# EAGLE design CDCEmu_v4.0 (EAGLE 9.6.2)
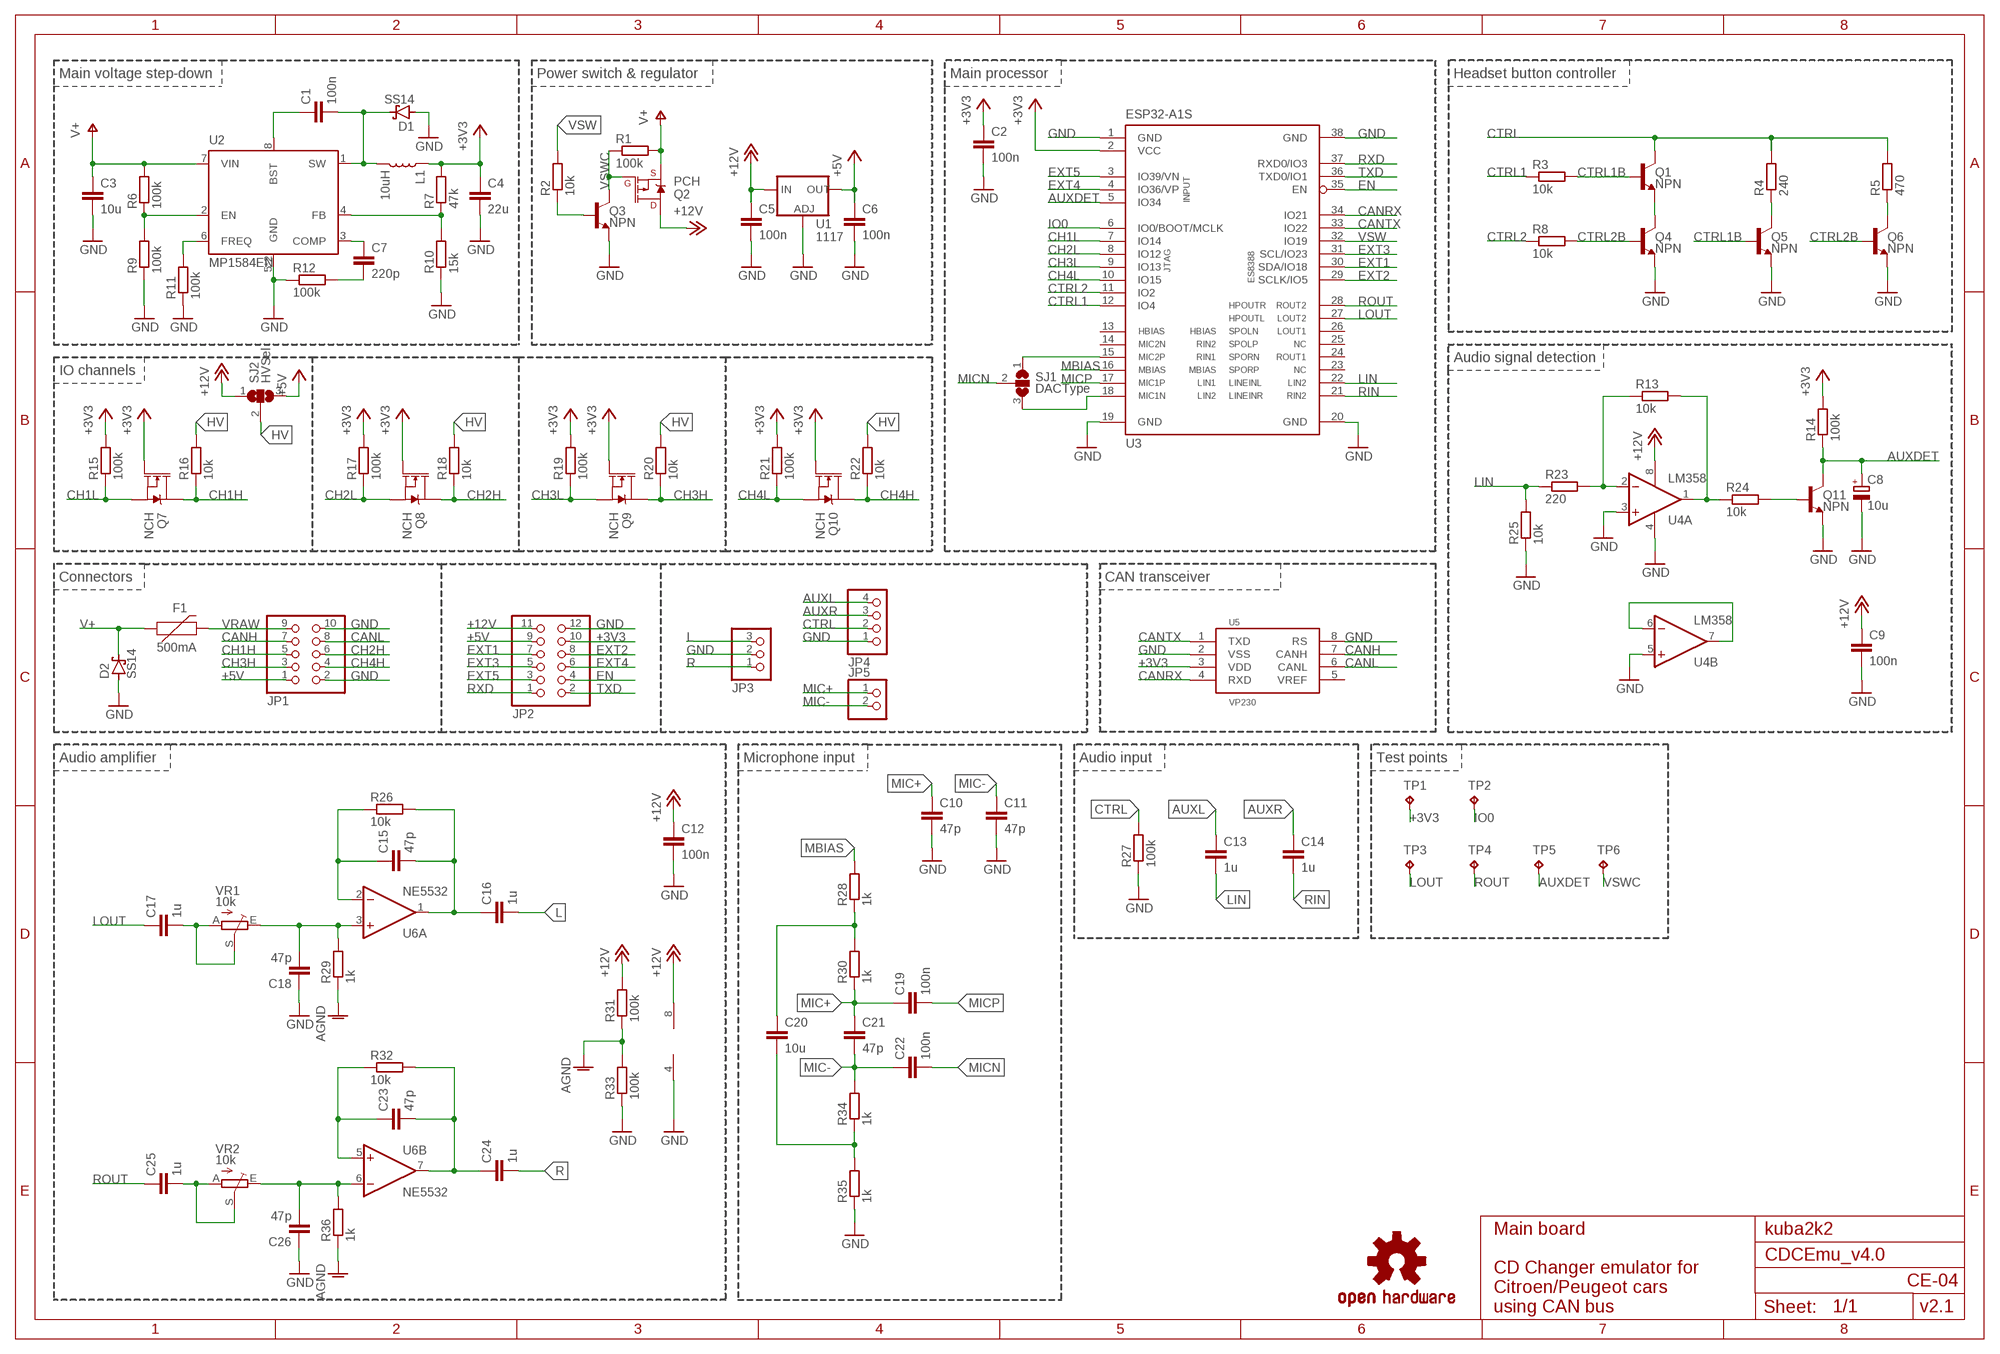
[diagram p0: schematic, sheet 1]

## Parts
C1  100n  C-EUC0805  [C0805]
C2  100n  C-EUC0805  [C0805]
C3  10u  C-EUC1206  [C1206]
C4  22u  C-EUC1206  [C1206]
C5  100n  C-EUC0805  [C0805]
C6  100n  C-EUC0805  [C0805]
C7  220p  C-EUC0805  [C0805]
C8  10u  CPOL-EUC1206  [C1206-POL]
C9  100n  C-EUC0805  [C0805]
C10  47p  C-EUC0805  [C0805]
C11  47p  C-EUC0805  [C0805]
C12  100n  C-EUC0805  [C0805]
C13  1u  C-EUC0805  [C0805]
C14  1u  C-EUC0805  [C0805]
C15  47p  C-EUC0805  [C0805]
C16  1u  C-EUC0805  [C0805]
C17  1u  C-EUC0805  [C0805]
C18  47p  C-EUC0805  [C0805]
C19  100n  C-EUC0805  [C0805]
C20  10u  C-EUC1206  [C1206]
C21  47p  C-EUC0805  [C0805]
C22  100n  C-EUC0805  [C0805]
C23  47p  C-EUC0805  [C0805]
C24  1u  C-EUC0805  [C0805]
C25  1u  C-EUC0805  [C0805]
C26  47p  C-EUC0805  [C0805]
D1  SS14  [DO-214AC]
D2  SS14  [DO-214AC]
F1  500mA  PPTC_6V500MA  [0805]
JP1  PINHD-2X5/90  [2X05/90]
JP2  PINHD-2X6/90  [2X06/90]
JP3  PINHD-1X3/90  [1X03/90]
JP4  PINHD-1X4/90  [1X04/90]
JP5  PINHD-1X2/90  [1X02/90]
L1  10uH  INDUCTOR-CR75-68UH  [CR75]
Q1  NPN  TRANS_NPN-MMBTA42  [SOT23-3]
Q2  PCH  MOSFET_PCH-IRLML2244  [SOT23-3]
Q3  NPN  TRANS_NPN-MMBTA42  [SOT23-3]
Q4  NPN  TRANS_NPN-MMBTA42  [SOT23-3]
Q5  NPN  TRANS_NPN-MMBTA42  [SOT23-3]
Q6  NPN  TRANS_NPN-MMBTA42  [SOT23-3]
Q7  NCH  MOSFET-NCH-AO3404A  [SOT23-3]
Q8  NCH  MOSFET-NCH-AO3404A  [SOT23-3]
Q9  NCH  MOSFET-NCH-AO3404A  [SOT23-3]
Q10  NCH  MOSFET-NCH-AO3404A  [SOT23-3]
Q11  NPN  TRANS_NPN-MMBTA42  [SOT23-3]
R1  100k  R-EU_R0805  [R0805]
R2  10k  R-EU_R0805  [R0805]
R3  10k  R-EU_R0805  [R0805]
R4  240  R-EU_R0805  [R0805]
R5  470  R-EU_R0805  [R0805]
R6  100k  R-EU_R0805  [R0805]
R7  47k  R-EU_R0805  [R0805]
R8  10k  R-EU_R0805  [R0805]
R9  100k  R-EU_R0805  [R0805]
R10  15k  R-EU_R0805  [R0805]
R11  100k  R-EU_R0805  [R0805]
R12  100k  R-EU_R0805  [R0805]
R13  10k  R-EU_R0805  [R0805]
R14  100k  R-EU_R0805  [R0805]
R15  100k  R-EU_R0805  [R0805]
R16  10k  R-EU_R0805  [R0805]
R17  100k  R-EU_R0805  [R0805]
R18  10k  R-EU_R0805  [R0805]
R19  100k  R-EU_R0805  [R0805]
R20  10k  R-EU_R0805  [R0805]
R21  100k  R-EU_R0805  [R0805]
R22  10k  R-EU_R0805  [R0805]
R23  220  R-EU_R0805  [R0805]
R24  10k  R-EU_R0805  [R0805]
R25  10k  R-EU_R0805  [R0805]
R26  10k  R-EU_R0805  [R0805]
R27  100k  R-EU_R0805  [R0805]
R28  1k  R-EU_R0805  [R0805]
R29  1k  R-EU_R0805  [R0805]
R30  1k  R-EU_R0805  [R0805]
R31  100k  R-EU_R0805  [R0805]
R32  10k  R-EU_R0805  [R0805]
R33  100k  R-EU_R0805  [R0805]
R34  1k  R-EU_R0805  [R0805]
R35  1k  R-EU_R0805  [R0805]
R36  1k  R-EU_R0805  [R0805]
SJ1  DACType  SJ2W  [SJ_2]
SJ2  HVSel  SJ2W  [SJ_2]
TP1  TPB1,27  [B1,27]
TP2  TPB1,27  [B1,27]
TP3  TPB1,27  [B1,27]
TP4  TPB1,27  [B1,27]
TP5  TPB1,27  [B1,27]
TP6  TPB1,27  [B1,27]
U1  1117  V_REG_LM1117SOT223  [SOT223]
U2  MP1584EN  MP1584EN_-PAD  [SO08-PAD]
U3  ESP32-A1S  [ESP32-A1S]
U4  LM358  LM358D  [SO08]
U5  VP230  SN65HVD230  [SO08]
U6  NE5532  LM358D  [SO08]
U$1  OSHW-LOGO  [OSHWLOGO_TOP_0.2_OUTLINE]
VR1  10k  TRIM_EU-CA6V  [CA6V]
VR2  10k  TRIM_EU-CA6V  [CA6V]

## Nets
+3V3 [power]: C2.1 C4.1 JP2.10 L1.P$1 Q7.1(G) Q8.1(G) Q9.1(G) Q10.1(G) R7.2 R14.2 R15.2 R17.2 R19.2 R21.2 TP1.TP U3.2(VCC) U5.3(VDD)
+5V [power]: C6.1 JP1.1 JP2.9 SJ2.3 U1.2(OUT) U1.4(OUT)
+12V [power]: C5.1 C9.1 C12.1 JP2.11 Q2.3(D) R31.2 SJ2.1 U1.3(IN) U4.8(P:V+) U6.8(P:V+)
AGND: R29.1 R31.1 R33.2 R36.1
AUXDET: C8.1(+) Q11.3(C) R14.1 TP5.TP U3.5(IO34)
AUXL: C13.1 JP4.4
AUXR: C14.1 JP4.3
BST: C1.1 U2.8(BST)
CANH: JP1.7 U5.7(CANH)
CANL: JP1.8 U5.6(CANL)
CANRX: U3.34(IO21) U5.4(RXD)
CANTX: U3.33(IO22) U5.1(TXD)
CCE: Q1.2(E) Q4.3(C)
CH1H: JP1.5 Q7.3(D) R16.1
CH1L: Q7.2(S) R15.1 U3.7(IO14)
CH2H: JP1.6 Q8.3(D) R18.1
CH2L: Q8.2(S) R17.1 U3.8(IO12)
CH3H: JP1.3 Q9.3(D) R20.1
CH3L: Q9.2(S) R19.1 U3.9(IO13)
CH4H: JP1.4 Q10.3(D) R22.1
CH4L: Q10.2(S) R21.1 U3.10(IO15)
COMP: C7.1 U2.3(COMP)
COMPD: C7.2 R12.2
CTRL: JP4.2 Q1.3(C) R4.2 R5.2 R27.2
CTRL1: R3.1 U3.12(IO4)
CTRL1B: Q1.1(B) Q5.1(B) R3.2
CTRL2: R8.1 U3.11(IO2)
CTRL2B: Q4.1(B) Q6.1(B) R8.2
DET-: R13.1 R23.2 U4.2(A:-IN)
DET_B: Q11.1(B) R24.2
DETOUT: R13.2 R24.1 U4.1(A:OUT)
EN: JP2.4 U3.35(EN)
EXT1: JP2.7 U3.30(SDA/IO18)
EXT2: JP2.8 U3.29(SCLK/IO5)
EXT3: JP2.5 U3.31(SCL/IO23)
EXT4: JP2.6 U3.4(IO36/VP)
EXT5: JP2.3 U3.3(IO39/VN)
FB: R7.1 R10.2 U2.4(FB)
FREQ: R11.2 U2.6(FREQ)
GND: C2.2 C3.2 C4.2 C5.2 C6.2 C8.2(-) C9.2 C10.2 C11.2 C12.2 C18.1 C26.1 D1.A D2.A JP1.2 JP1.10 JP2.12 JP3.2 JP4.1 Q3.2(E) Q4.2(E) Q5.2(E) Q6.2(E) Q11.2(E) R9.1 R10.1 R11.1 R12.1 R25.1 R27.1 R33.1 R35.1 U1.1(ADJ) U2.5(GND) U2.PAD(GND) U3.1(GND) U3.19(GND) U3.20(GND) U3.38(GND) U4.3(A:+IN) U4.4(P:V-) U4.5(B:+IN) U5.2(VSS) U5.8(RS) U6.4(P:V-)
HV [power]: R16.2 R18.2 R20.2 R22.2 SJ2.2
IO0: TP2.TP U3.6(IO0/BOOT/MCLK)
L: C16.2 JP3.3
LF: C17.2 VR1.A VR1.S
LFB: C15.2 C16.1 R26.2 U6.1(A:OUT)
LIN: C13.2 R23.1 R25.2 U3.22(LINEINL/LIN2)
LNEG: C15.1 R26.1 U6.2(A:-IN)
LOUT: C17.1 TP3.TP U3.27(HPOUTL/LOUT2)
LPOS: C18.2 R29.2 U6.3(A:+IN) VR1.E
MBIAS: R28.2 U3.16(MBIAS)
MG+: C20.1 R28.1 R30.2
MG-: C20.2 R34.1 R35.2
MIC1N: SJ1.3 U3.18(MIC1N/LIN2)
MIC+: C10.1 C19.1 C21.1 JP5.1 R30.1
MIC-: C11.1 C21.2 C22.1 JP5.2 R34.2
MICN: C22.2 SJ1.2
MICP: C19.2 U3.17(MIC1P/LIN1)
MPEN: R6.1 R9.2 U2.2(EN)
Q8C: Q5.3(C) R4.1
Q9C: Q6.3(C) R5.1
R: C24.2 JP3.1
RF: C25.2 VR2.A VR2.S
RFB: C23.2 C24.1 R32.2 U6.7(B:OUT)
RIN: C14.2 U3.21(LINEINR/RIN2)
RIN1: SJ1.1 U3.15(MIC2P/RIN1)
RNEG: C23.1 R32.1 U6.5(B:+IN)
ROUT: C25.1 TP4.TP U3.28(HPOUTR/ROUT2)
RPOS: C26.2 R36.2 U6.6(B:-IN) VR2.E
RXD: JP2.1 U3.37(RXD0/IO3)
SW [power]: C1.2 D1.C L1.P$2 U2.1(SW)
TXD: JP2.2 U3.36(TXD0/IO1)
U4FB: U4.6(B:-IN) U4.7(B:OUT)
V+ [power]: C3.1 D2.C F1.1 Q2.2(S) R1.2 R6.2 U2.7(VIN)
VRAW [power]: F1.2 JP1.9
VSW: R2.2 U3.32(IO19)
VSWB: Q3.1(B) R2.1
VSWC: Q2.1(G) Q3.3(C) R1.1 TP6.TP
Unconnected: U3.13(HBIAS) U3.14(MIC2N/RIN2) U3.23(SPORP/NC) U3.24(SPORN/ROUT1) U3.25(SPOLP/NC) U3.26(SPOLN/LOUT1) U5.5(VREF)

## Notes on the sheet
- Main voltage step-down | Power switch & regulator | Main processor | Headset button controller
- Audio signal detection
- IO channels
- Connectors | CAN transceiver
- Audio amplifier | Microphone input | Audio input | Test points
- Main board | kuba2k2
- CE-04
- CD Changer emulator for
  Citroen/Peugeot cars
  using CAN bus
- v2.1

## Library data of the parts
C1-C7 C9-C26 = rcl:C-EU: CAPACITOR, European symbol; SPICEPREFIX: C
C8 = custom:CPOL-EU
D1 D2 = custom:SS*
F1 = SparkFun-Fuses:PPTC: Resettable Fuse PPTC Resettable Fuse. Really a sort of resistor with a polymeric positive temperature coefficient whose resistance increases dramatically with an increase in temperature. When heated by the power passing through the resistance rises causing the current to be limited, protecting the circuit. This is achieved by the transition of the polymer from a crystalline to an amorphous state where the conductive carbon separates breaking the conductive pathways found in the cool crystalline structure. When a PPTC cools back down it resumes conducting letting the circuit turn back on. SparkFun Products: SparkFun RedBoard - Programmed with Arduino <https://www.sparkfun.com/products/12757> Pro Micro - 5V/16MHz <https://www.sparkfun.com/products/12640> Arduino Pro 328 - 5V/16MHz <https://www.sparkfun.com/products/10915> MP3 Trigger <https://www.sparkfun.com/products/13720>; PROD_ID: RES-13945; VALUE: 6V 0.5A
JP1 = pinhead-external:PINHD-2X5: PIN HEADER
JP2 = pinhead-external:PINHD-2X6: PIN HEADER
JP3 = pinhead-external:PINHD-1X3: PIN HEADER
JP4 = pinhead-external:PINHD-1X4: PIN HEADER
JP5 = pinhead-external:PINHD-1X2: PIN HEADER
L1 = SparkFun-Coils:INDUCTOR: Inductors Resist changes in electrical current. Basically a coil of wire. SparkFun Products: SparkFun Load Cell Amplifier - HX711 <https://www.sparkfun.com/products/13879> IOIO-OTG - V2.2 <https://www.sparkfun.com/products/13613>; PROD_ID: NDUC-09739; VALUE: 68µH/±20%/1.05A
Q1 Q3-Q6 Q11 = SparkFun-DiscreteSemi:TRANS_NPN: NPN transistor Current controlled devices typically used to amplify current or used as a switch. BC547 - COM-08928 <http://www.sparkfun.com/products/8928> (TO-92 45V 100mA) (1.Collector 2.Base 3.Emitter) 2N3904 - COM-00521 <http://www.sparkfun.com/products/521> (TO-92 40V 200mA) (1.Emitter 2.Base 3.Collector) P2N2222A - COM-12852 <http://www.sparkfun.com/products/12852> (TO-92 40V 600mA) (1.Collector 2.Base 3.Emitter); PROD_ID: TRANS-09116; VALUE: 500mA/300V
Q2 = SparkFun-DiscreteSemi:MOSFET_PCH: P-channel MOSFETs Voltage controlled devices that allow control of high current outputs. SparkFun Products: SparkFun ESP32 Thing <https://www.sparkfun.com/products/13907> SparkFun ESP8266 Thing <https://www.sparkfun.com/products/13231> SparkFun Pi Servo HAT V2 <https://www.sparkfun.com/products/15316> DMG2305UX-7 (20V/4.2A/SOT23-3); PROD_ID: TRANS-11153; VALUE: 4.3A/20V/54mΩ
Q7-Q10 = SparkFun-DiscreteSemi:MOSFET-NCH: N-channel MOSFETs Voltage controlled devices that allow control of high current outputs. SparkFun Products: SparkFun OpenScale <https://www.sparkfun.com/products/13261> SparkFun Digital Sandbox <https://www.sparkfun.com/products/12651> SparkFun Monster Moto Shield <https://www.sparkfun.com/products/10182> SparkFun MOSFET Power Controller <https://www.sparkfun.com/products/11214>; PROD_ID: TRANS-12988; VALUE: 5.8A/30V/35mΩ
R1-R36 = rcl:R-EU_: RESISTOR, European symbol; SPICEPREFIX: R
SJ1 SJ2 = jumper:SJ2W: SMD solder JUMPER
TP1-TP6 = testpad:TP: Test pad
U1 = SparkFun-IC-Power:V_REG_LM1117: Voltage Regulator LM1117 Standard adjustable voltage regulator but in SMD form. Spark Fun Electronics SKU : COM-00595; PROD_ID: VREG-08170
U2 = custom:MP1584EN_
U3 = ESP32-A1S:ESP32-A1S: No description set
U4 U6 = custom:LM358: OP AMP also LM158; LM258; LM2904 Source: http://cache.national.com/ds/LM/LM158.pdf
U5 = can_driver:SN65HVD230: CAN PHY driver 3.3-V CAN TRANSCEIVERS
U$1 = custom:OSHW-LOGO
VR1 VR2 = pot:TRIM_EU-: POTENTIOMETER

## Net classes
0 default: width 0.254 mm
1 power: width 0.406 mm

## Board
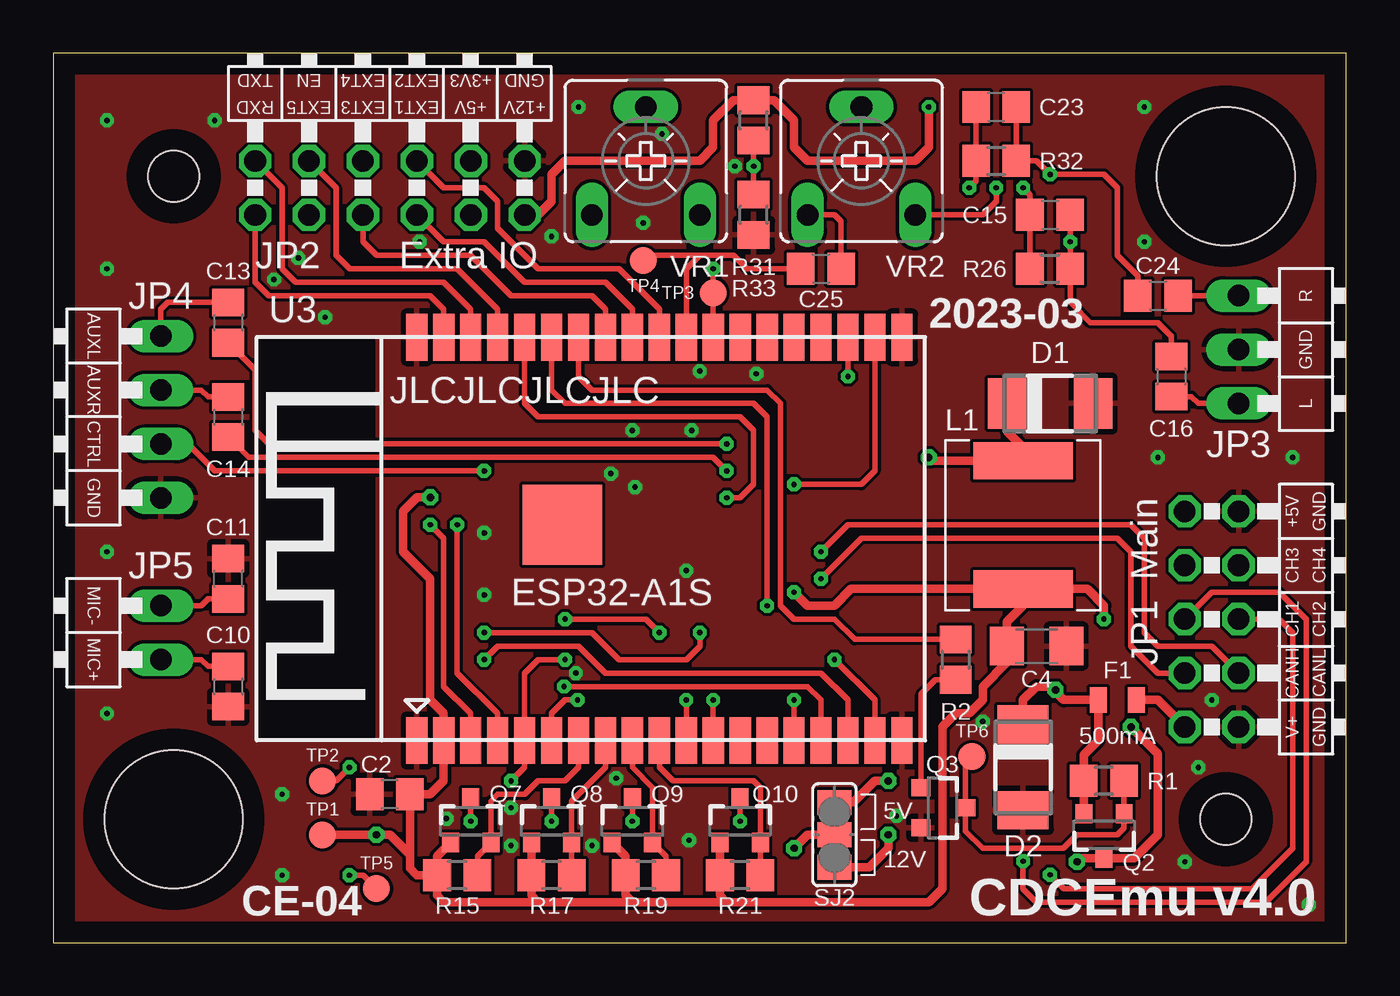
[diagram p1: board, top side]
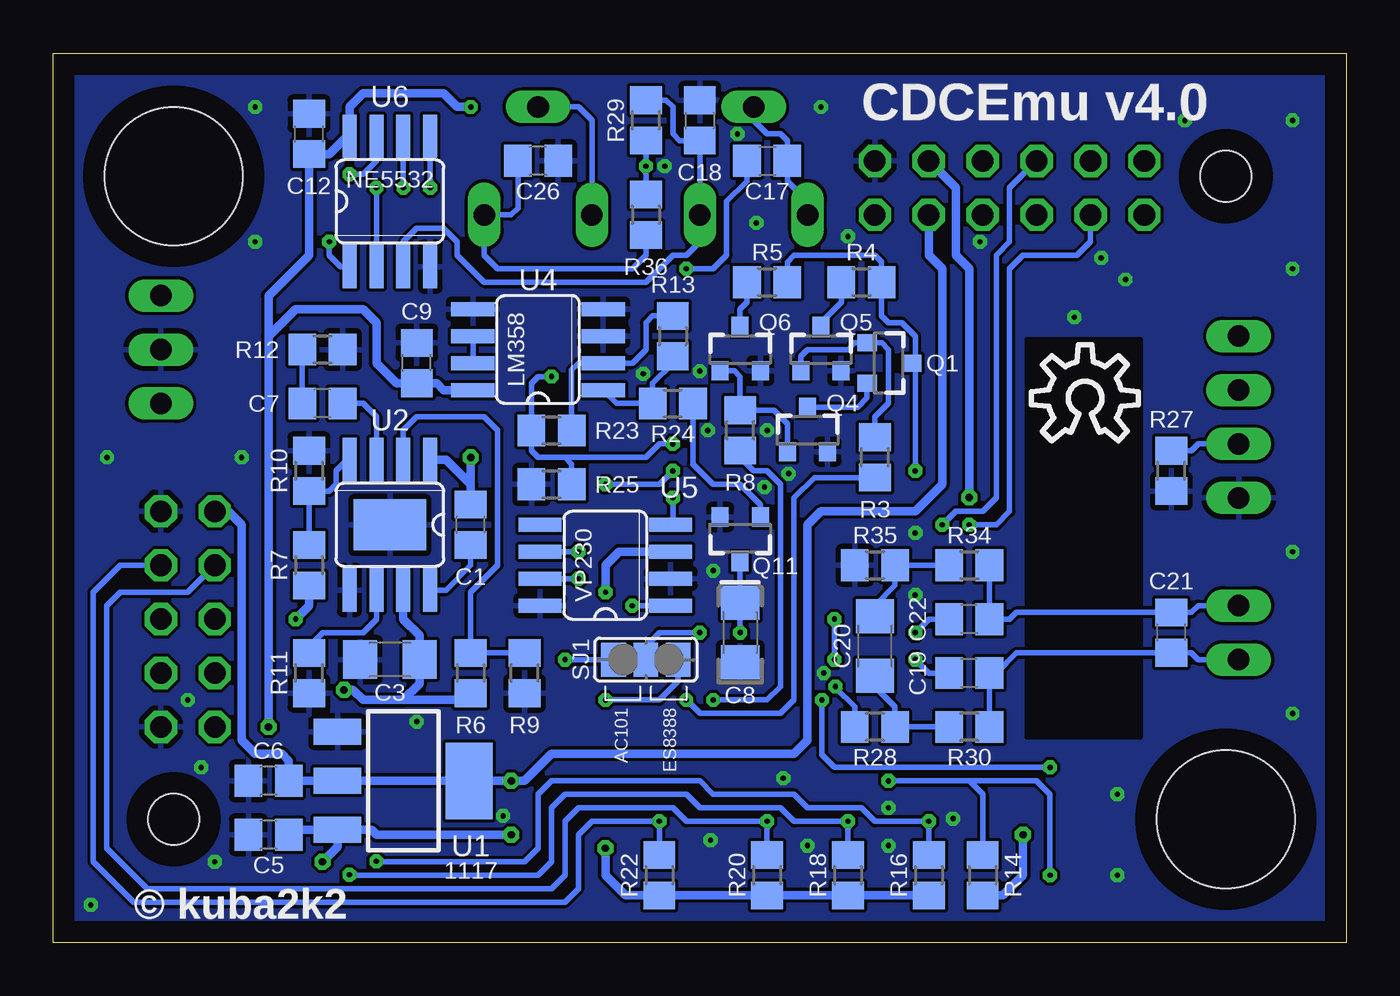
[diagram p2: board, bottom side, seen from below]

Size 60.96 x 41.91 mm. Coordinates in mm from the lower left corner, seen from the top.
Outline: 0,0 60.96,0 60.96,41.91 0,41.91 0,0
Copper layers (1*16): Top 0.035mm / dielectric 1.5mm / Bottom 0.035mm
Design rules "default *": minimum track width 6mil, minimum drill 0.25mm, track to track 6mil, track to pad 6mil, pad to pad 6mil, via to via 6mil, smd to smd 6mil, copper to edge 40mil, drill to drill 6mil, minimum pad ring 10mil, minimum via ring 8mil, stop-mask expansion 4mil, vias tented up to drill 16mil, thermal gap 10mil
Holes 6.5 mm at 5.68,5.8 55.28,36.1
Holes 2.4 mm at 5.68,36.1 55.28,5.8

### Footprints (pad centres in the part's own frame; a part is rotated, then mirrored left to right if it is on the bottom)
C0805 = smd 1.3 x 1.5: 1 -0.95,0; 2 0.95,0
C1206 = smd 1.6 x 1.8: 1 -1.4,0; 2 1.4,0
C1206-POL = smd 1.6 x 1.8: 1 -1.4,0; 2 1.4,0
DO-214AC = smd 1.8 x 2.4: A 2.025,0; C -2.025,0
0805 = smd 0.8 x 1.2: 1 -0.9,0; 2 0.9,0
2X05/90 = drill 1.016 octagon: 1 -5.08,-6.35; 2 -5.08,-3.81; 3 -2.54,-6.35; 4 -2.54,-3.81; 5 0,-6.35; 6 0,-3.81; 7 2.54,-6.35; 8 2.54,-3.81; 9 5.08,-6.35; 10 5.08,-3.81
2X06/90 = drill 1.016 octagon: 1 -6.35,-6.35; 2 -6.35,-3.81; 3 -3.81,-6.35; 4 -3.81,-3.81; 5 -1.27,-6.35; 6 -1.27,-3.81; 7 1.27,-6.35; 8 1.27,-3.81; 9 3.81,-6.35; 10 3.81,-3.81; 11 6.35,-6.35; 12 6.35,-3.81
1X03/90 = drill 1.016 long: 1 -2.54,-3.81; 2 0,-3.81; 3 2.54,-3.81
1X04/90 = drill 1.016 long: 1 -3.81,-3.81; 2 -1.27,-3.81; 3 1.27,-3.81; 4 3.81,-3.81
1X02/90 = drill 1.016 long: 1 -1.27,-3.81; 2 1.27,-3.81
CR75 = smd 1.75 x 4.7: P$1 -3.025,0; P$2 3.025,0
SOT23-3 = smd 0.8 x 0.9: 1 -0.95,-1; 2 0.95,-1; 3 0,1.1
R0805 = smd 1.3 x 1.5: 1 -0.95,0; 2 0.95,0
SJ_2 = smd 1.168 x 1.6: 1 -1.524,0; 2 0,0; 3 1.524,0
B1,27 = smd 1.27 x 1.27: TP 0,0
SOT223 = smd 1.219 x 2.235: 1 -2.311,-3.099; 2 0,-3.099; 3 2.311,-3.099 | smd 3.6 x 2.2: 4 0,3.099
SO08-PAD = smd 0.66 x 2.032: 1 -1.905,-3.073; 2 -0.635,-3.073; 3 0.635,-3.073; 4 1.905,-3.073; 5 1.905,3.073; 6 0.635,3.073; 7 -0.635,3.073; 8 -1.905,3.073 | smd 3.4 x 2.4: PAD 0,0
ESP32-A1S = smd 2.2 x 1: 1 -9.525,8.255; 2 -9.525,6.985; 3 -9.525,5.715; 4 -9.525,4.445; 5 -9.525,3.175; 6 -9.525,1.905; 7 -9.525,0.635; 8 -9.525,-0.635; 9 -9.525,-1.905; 10 -9.525,-3.175; 11 -9.525,-4.445; 12 -9.525,-5.715; 13 -9.525,-6.985; 14 -9.525,-8.255; 15 -9.525,-9.525; 16 -9.525,-10.795; 17 -9.525,-12.065; 18 -9.525,-13.335; 19 -9.525,-14.605; 20 9.475,-14.605; 21 9.475,-13.335; 22 9.475,-12.065; 23 9.475,-10.795; 24 9.475,-9.525; 25 9.475,-8.255; 26 9.475,-6.985; 27 9.475,-5.715; 28 9.475,-4.445; 29 9.475,-3.175; 30 9.475,-1.905; 31 9.475,-0.635; 32 9.475,0.635; 33 9.475,1.905; 34 9.475,3.175; 35 9.475,4.445; 36 9.475,5.715; 37 9.475,6.985; 38 9.475,8.255 | smd 3.785 x 3.759: 39 0.635,1.397
SO08 = smd 0.66 x 2.032: 1 -1.905,-3.073; 2 -0.635,-3.073; 3 0.635,-3.073; 4 1.905,-3.073; 5 1.905,3.073; 6 0.635,3.073; 7 -0.635,3.073; 8 -1.905,3.073
CA6V = drill 1.016 long: A -2.54,-2.54; E 2.54,-2.54; S 0,2.54

### Placement (x,y rotation side)
C1  41.27,19.68 90 bottom
C2  15.88,6.99 180 top
C3  45.09,13.34 180 bottom
C4  46.35,13.97 0 top
C5  50.8,5.08 180 bottom
C6  50.8,7.62 180 bottom
C7  48.26,25.4 180 bottom
C8  28.57,14.61 270 bottom
C9  43.81,27.3 90 bottom
C10  8.26,12.06 270 top
C11  8.26,17.14 90 top
C12  48.9,38.1 90 bottom
C13  8.26,29.21 270 top
C14  8.26,24.77 270 top
C15  46.99,34.29 0 top
C16  52.7,26.67 270 top
C17  27.3,36.83 0 bottom
C18  30.48,38.73 270 bottom
C19  17.78,12.7 180 bottom
C20  22.23,13.97 90 bottom
C21  8.26,14.61 90 bottom
C22  17.78,15.24 180 bottom
C23  44.45,39.37 0 top
C24  52.07,30.48 0 top
C25  36.2,31.75 0 top
C26  38.1,36.83 180 bottom
D1  46.99,25.4 0 top
D2  45.72,8.26 270 top
F1  50.16,11.43 0 top
JP1  59.69,15.24 270 top
JP2  15.88,40.64 0 top
JP3  59.69,27.94 270 top
JP4  1.27,24.77 90 top
JP5  1.27,14.61 90 top
L1  45.72,19.68 90 top
Q1  21.59,27.3 270 bottom
Q2  49.53,5.08 180 top
Q3  41.91,6.35 270 top
Q4  25.4,24.13 0 bottom
Q5  24.77,27.94 0 bottom
Q6  28.57,27.94 0 bottom
Q7  19.68,5.71 0 top
Q8  23.5,5.71 0 top
Q9  27.3,5.71 0 top
Q10  32.38,5.71 0 top
Q11  28.57,19.05 180 bottom
R1  49.53,7.62 180 top
R2  42.55,13.34 90 top
R3  22.23,22.86 90 bottom
R4  22.86,31.11 0 bottom
R5  27.3,31.11 0 bottom
R6  41.27,12.7 270 bottom
R7  48.9,17.78 270 bottom
R8  28.57,24.13 90 bottom
R9  38.73,12.7 90 bottom
R10  48.9,22.23 270 bottom
R11  48.9,12.7 90 bottom
R12  48.26,27.94 180 bottom
R13  31.75,28.57 270 bottom
R14  17.14,3.17 270 bottom
R15  19.05,3.17 180 top
R16  19.68,3.17 270 bottom
R17  23.5,3.17 180 top
R18  23.5,3.17 270 bottom
R19  27.94,3.17 180 top
R20  27.3,3.17 270 bottom
R21  32.38,3.17 180 top
R22  32.38,3.17 270 bottom
R23  37.47,24.13 0 bottom
R24  31.75,25.4 0 bottom
R25  37.47,21.59 0 bottom
R26  46.99,31.75 0 top
R27  8.26,22.23 90 bottom
R28  22.23,10.16 180 bottom
R29  33.02,38.73 90 bottom
R30  17.78,10.16 180 bottom
R31  33.02,38.73 90 top
R32  44.45,36.83 0 top
R33  33.02,34.29 90 top
R34  17.78,17.78 0 bottom
R35  22.23,17.78 0 bottom
R36  33.02,34.29 270 bottom
SJ1  33.02,13.34 180 bottom
SJ2  36.83,5.08 90 top
TP1  12.7,5.08 0 top
TP2  12.7,7.62 0 top
TP3  31.11,30.61 0 top
TP4  27.81,32.13 0 top
TP5  15.24,2.54 0 top
TP6  43.31,8.76 0 top
U1  44.45,7.62 270 bottom
U2  45.09,19.68 180 bottom
U3  25.4,19.05 90 top
U4  38.1,27.94 90 bottom
U5  34.92,17.78 90 bottom
U6  45.09,34.92 0 bottom
U$1  12.32,25.65 0 bottom
VR1  27.94,36.83 0 top
VR2  38.1,36.83 0 top

### Tracks (layer width: path | path; a pad name or v marks a point on that pad's centre or on a via)
+3V3  (via drill 0.25, 0.35)
  Top 0.406: 22.86,1.91 18.41,1.91 18.1,2.22 R15.2 | 22.86,1.91 27.3,1.91 | 27.3,1.91 31.75,1.91 | 22.86,1.91 22.55,2.22 R17.2 Q8.1 | 27.3,1.91 26.99,2.22 R19.2 26.99,4.08 Q9.1 | 31.75,1.91 31.43,2.22 R21.2 Q10.1 | R15.2 18.1,4.08 Q7.1 | L1.P$1 45.72,15.88 44.95,15.11 C4.1 44.95,13.21 43.81,12.06 43.81,11.43 43.18,10.79 42.55,10.79 41.91,10.16 41.91,2.54 41.27,1.91 31.75,1.91 | R15.2 17.14,3.17 16.82,3.5 16.82,4.13 | 16.82,4.13 C2.1 17.78,6.99 18.41,7.62 U3.2 18.41,10.79 17.78,11.43 17.78,17.14 16.51,18.41 16.51,20.32 17.17,20.98 v17.78,20.98 | v49.53,15.24 49.53,15.88 48.74,16.66 L1.P$1 | 16.82,4.13 15.88,5.08 v15.24,5.08 TP1.TP | L1.P$1 37.62,16.66 36.83,15.88 35.56,15.88 v34.92,16.51
  Bottom 0.406: R7.2 48.9,15.88 v49.53,15.24 | R14.2 16.19,2.23 15.24,3.17 v15.24,5.08 | v17.78,20.98 17.78,31.75 18.41,32.38 18.41,35.56 JP2.10 | U5.3 34.29,18.41 34.92,17.78 v34.92,16.51
+5V  (via drill 0.35)
  Top 0.406: SJ2.3 37.72,6.6 38.73,7.62 v39.37,7.62
  Bottom 0.406: JP2.9 19.68,32.38 19.05,31.75 19.05,21.59 20.32,20.32 24.77,20.32 25.4,19.68 25.4,9.53 26.04,8.89 37.47,8.89 38.73,7.62 v39.37,7.62 U1.4 U1.2 C6.1 49.85,8.57 50.16,8.89 51.44,8.89 52.07,9.53 52.07,19.68 52.7,20.32 JP1.1
+12V  (via drill 0.25, 0.35)
  Top 0.406: v41.27,39.37 41.27,37.47 40.64,36.83 35.56,36.83 34.92,37.47 34.92,38.73 33.98,39.69 R31.2 32.06,39.69 31.11,38.73 31.11,37.47 30.48,36.83 24.13,36.83 23.5,36.2 23.5,34.92 22.86,34.29 JP2.11 | SJ2.1 38.48,3.56 39.37,4.45 v39.37,5.08 | v50.8,10.16 52.07,8.89 52.07,5.08 50.97,3.98 Q2.3 48.43,3.98 v48.26,3.81
  Bottom 0.406: v41.27,39.37 41.91,39.37 42.55,40.01 46.35,40.01 46.99,39.37 U6.8 47.09,38 47.94,37.15 C12.1 48.9,32.38 50.8,30.48 50.8,28.57 | U1.3 49.62,5.31 C5.1 | U1.3 45.95,5.31 45.72,5.08 v39.37,5.08 | 50.8,28.57 v50.8,10.16 | U4.8 42.55,26.04 42.87,26.36 C9.1 44.77,26.36 45.72,27.3 45.72,29.21 46.35,29.84 49.53,29.84 50.8,28.57 | U1.3 47.55,4.52 v48.26,3.81
AGND  (via drill 0.25)
  Top 0.254: R36.1 v33.02,36.58 R31.1
  Bottom 0.254: R36.1 v33.02,36.58 R31.1
AUXDET  (via drill 0.25)
  Top 0.254: v24.13,13.34 22.86,13.34 22.23,12.7 U3.5 22.23,8.26 v21.59,7.62 | v24.13,15.24 27.94,15.24 v28.57,14.61 | TP5.TP 14.61,3.17 v13.97,3.17
  Bottom 0.254: v24.13,13.34 v24.13,15.24 | 17.78,7.62 17.14,6.99 R14.1 | v21.59,7.62 17.78,7.62 | v28.57,14.61 C8.1 Q11.3 | v13.97,3.17 13.97,6.99 14.61,7.62 17.78,7.62
AUXL
  Top 0.254: C13.1 5.39,30.16 5.08,29.84 JP4.4
AUXR
  Top 0.254: C14.1 7.3,25.71 6.99,26.04 JP4.3
BST
  Bottom 0.254: C1.1 41.27,17.78 42.44,16.61 U2.8
CANH  (via drill 0.25)
  Top 0.254: v36.2,17.14 38.1,19.05 50.16,19.05 50.8,18.41 50.8,13.97 52.07,12.7 JP1.7
  Bottom 0.254: U5.7 v36.2,17.14
CANL  (via drill 0.25)
  Top 0.254: v36.2,18.41 37.47,19.68 50.8,19.68 51.44,19.05 51.44,14.61 52.07,13.97 54.61,13.97 JP1.8
  Bottom 0.254: U5.6 v36.2,18.41
CANRX  (via drill 0.25)
  Top 0.254: U3.34 22.23,25.4 22.86,24.77 32.38,24.77 33.02,24.13 33.02,21.59 32.38,20.95 v31.75,20.95
  Bottom 0.254: U5.4 31.75,19.79 v31.75,20.95
CANTX  (via drill 0.25)
  Top 0.254: U3.33 23.5,26.04 24.13,25.4 33.02,25.4 33.66,24.77 v33.66,15.88
  Bottom 0.254: v33.66,15.88 U5.1
CCE
  Bottom 0.254: Q4.3 23.03,25.23 22.59,25.67 Q1.2
CH1H  (via drill 0.25)
  Top 0.254: Q7.3 v19.68,5.71 | v45.72,3.83 45.72,2.54 46.35,1.91 57.15,1.91 59.05,3.81 59.05,15.24 57.78,16.51 54.61,16.51 JP1.5
  Bottom 0.254: R16.1 v19.68,5.71 22.23,5.71 22.86,6.35 25.4,6.35 26.04,6.99 29.84,6.99 30.48,7.62 37.47,7.62 38.1,6.99 38.1,4.45 38.73,3.81 45.72,3.81 v45.72,3.83
CH1L
  Top 0.254: R15.1 20,4.08 Q7.2 20.64,6.67 20.95,6.99 22.23,6.99 22.86,7.62 24.13,7.62 24.77,8.26 U3.7
CH2H  (via drill 0.25)
  Top 0.254: Q8.3 v23.5,5.71 | v46.99,3.2 47.65,2.54 56.52,2.54 58.42,4.45 58.42,14.61 57.78,15.24 JP1.6
  Bottom 0.254: R18.1 v23.5,5.71 26.04,5.71 26.67,6.35 30.48,6.35 31.11,6.99 36.83,6.99 37.47,6.35 37.47,3.81 38.1,3.17 46.99,3.17 v46.99,3.2
CH2L
  Top 0.254: R17.1 Q8.2 24.45,6.67 26.04,8.26 U3.8
CH3H  (via drill 0.25)
  Top 0.254: Q9.3 v27.3,5.71
  Bottom 0.254: R20.1 v27.3,5.71 31.11,5.71 31.75,6.35 36.2,6.35 36.83,5.71 36.83,3.17 37.47,2.54 56.52,2.54 58.42,4.45 58.42,15.88 57.78,16.51 54.61,16.51 JP1.3
CH3L
  Top 0.254: U3.9 27.3,8.26 28.25,7.3 Q9.2 28.89,4.08 R19.1
CH4H  (via drill 0.25)
  Top 0.254: Q10.3 v32.38,5.71
  Bottom 0.254: R22.1 v32.38,5.71 35.56,5.71 36.2,5.08 36.2,2.54 36.83,1.91 57.15,1.91 59.05,3.81 59.05,16.51 57.78,17.78 JP1.4
CH4L
  Top 0.254: R21.1 Q10.2 33.34,7.3 33.02,7.62 29.21,7.62 28.57,8.26 U3.10
COMP
  Bottom 0.254: U2.3 45.72,24.77 46.35,25.4 C7.1
COMPD
  Bottom 0.254: R12.2 C7.2
CTRL  (via drill 0.25)
  Top 0.254: v20.32,22.23 7.62,22.23 6.35,23.5 JP4.2
  Bottom 0.254: R27.2 7.3,23.18 6.99,23.5 JP4.2 | v20.32,22.23 20.32,27.14 Q1.3 20.32,27.48 20.32,28.57 20.95,29.21 21.59,29.21 21.91,29.53 R4.2 21.91,32.07 22.23,32.38 26.04,32.38 26.36,32.06 R5.2
CTRL1  (via drill 0.25)
  Top 0.254: v31.11,11.43 U3.12
  Bottom 0.254: v31.11,11.43 30.48,10.79 26.67,10.79 26.04,11.43 26.04,20.95 25.08,21.91 R3.1
CTRL1B
  Bottom 0.254: R3.2 22.23,24.77 21.59,25.4 21.59,27.94 21.91,28.25 Q1.1 23.18,28.25 23.5,27.94 25.4,27.94 25.71,27.62 Q5.1
CTRL2  (via drill 0.25)
  Top 0.254: U3.11 v29.84,11.43
  Bottom 0.254: v29.84,11.43 27.3,11.43 26.67,12.06 26.67,21.59 27.3,22.23 27.94,22.23 28.57,22.86 R8.1
CTRL2B
  Bottom 0.254: Q4.1 26.35,24.45 26.98,25.08 R8.2 28.57,26.67 28.84,26.94 Q6.1
DET-
  Bottom 0.254: R13.1 32.7,29.52 33.02,29.21 33.02,27.94 33.66,27.3 U4.2 36.2,27.3 36.52,26.98 R23.2
DET_B
  Bottom 0.254: Q11.1 27.62,20.64 28.57,21.59 29.84,21.59 30.8,22.55 R24.2
DETOUT
  Bottom 0.254: R13.2 31.75,27.3 32.7,26.36 R24.1 34.39,25.4 U4.1
EN
  Top 0.254: U3.35 20.95,29.84 19.05,31.75 13.97,31.75 13.34,32.38 13.34,35.56 JP2.4
EXT1
  Top 0.254: U3.30 27.3,29.84 26.04,31.11 22.23,31.11 20.32,33.02 18.41,33.02 JP2.7
EXT2
  Top 0.254: U3.29 28.57,29.84 26.67,31.75 22.86,31.75 20.95,33.66 20.95,34.92 20.32,35.56 18.41,35.56 JP2.8
EXT3
  Top 0.254: U3.31 26.04,29.84 25.4,30.48 21.59,30.48 19.68,32.38 15.24,32.38 14.61,33.02 JP2.5
EXT4  (via drill 0.25)
  Top 0.254: U3.4 20.95,10.79 19.05,12.7 v19.05,19.68
  Bottom 0.254: v19.05,19.68 18.41,20.32 17.14,20.32 16.51,20.95 16.51,32.38 15.88,33.02 15.88,35.56 JP2.6
EXT5  (via drill 0.25)
  Top 0.254: U3.3 19.68,10.79 18.41,12.06 18.41,19.05 v17.78,19.68
  Bottom 0.254: v17.78,19.68 16.51,19.68 15.88,20.32 15.88,31.75 15.24,32.38 12.7,32.38 12.06,33.02 JP2.3
FB
  Bottom 0.254: R7.1 R10.2 47.94,21.27 47.62,21.59 47.62,22.23 47.09,22.76 U2.4
FREQ
  Bottom 0.254: U2.6 45.72,15.24 46.35,14.61 48.26,14.61 48.9,13.97 R11.2
GND  (via drill 0.25)
  other vias: 26.29,22.1 27.43,21.46 30.1,24.13 27.3,24.13 17.27,33.02 23.5,33.27 11.56,32.26 10.41,31.24 30.48,26.92 33.15,26.8 27.81,33.91 32.13,36.58 51.44,33.02 51.44,39.37 52.07,22.86 58.42,22.86 54.61,11.43 53.98,8.26 53.34,3.81 59.18,1.78 10.79,3.17 10.79,6.99 2.54,10.79 2.54,18.41 2.54,31.75 2.54,38.73 7.62,38.73 24.77,39.37 29.84,17.53 20.32,19.3 20.32,16.38 18.54,5.84 21.59,6.35 26.54,7.75 39.75,5.97 24.64,12.7 21.59,4.57 25.4,4.57 29.97,4.83 12.83,29.46 43.81,10.41 28.7,38.1
  pour Top (rank 2): 0,0 60.96,0 60.96,41.91 0,41.91
  pour Bottom: 0,0 60.96,0 60.96,41.91 0,41.91
  cutout Bottom (rank 2): 9.65,28.45 15.11,28.45 15.11,9.65 9.65,9.65
  cutout Top: 9.65,28.45 15.11,28.45 15.11,9.65 9.65,9.65
HV  (via drill 0.35)
  Top 0.406: SJ2.2 35.56,5.08 v34.92,4.45
  Bottom 0.406: R16.2 R18.2 R20.2 R22.2 33.98,2.23 34.92,3.17 v34.92,4.45
IO0  (via drill 0.25)
  Top 0.254: U3.6 23.5,10.79 24.13,11.43 v24.72,11.43 | v13.97,8.26 13.34,7.62 TP2.TP
  Bottom 0.254: v24.72,11.43 24.72,8.84 24.13,8.26 v13.97,8.26
L
  Top 0.254: C16.2 53.66,25.72 53.98,25.4 JP3.3
LF
  Bottom 0.254: VR1.A 25.4,34.92 26.36,35.88 C17.2 26.36,37.78 26.67,38.1 27.3,38.1 27.94,38.73 VR1.S
LFB  (via drill 0.25)
  Top 0.254: C15.2 v47.94,33.02 R26.2 47.94,30.16 48.9,29.21 52.07,29.21 52.7,28.57 C16.1
  Bottom 0.254: v47.94,33.02 47.94,32.38 47.41,31.85 U6.1
LIN  (via drill 0.25)
  Top 0.254: v37.47,26.67 U3.22 | v31.75,23.5 10.16,23.5 9.53,24.13 9.53,26.99 C13.2
  Bottom 0.254: v37.47,26.67 38.1,26.67 38.41,26.36 R23.1 38.41,23.18 38.1,22.86 36.83,22.86 | R25.2 36.52,22.55 36.83,22.86 | 36.83,22.86 33.02,22.86 32.38,23.5 v31.75,23.5
LNEG  (via drill 0.25)
  Top 0.254: v45.72,35.56 46.04,35.24 C15.1 R26.1
  Bottom 0.254: U6.2 v45.72,35.56
LOUT  (via drill 0.25)
  Top 0.254: U3.27 v31.11,31.75 TP3.TP
  Bottom 0.254: v31.11,31.75 29.84,31.75 29.21,32.38 29.21,34.92 28.25,35.88 C17.1
LPOS
  Bottom 0.254: R29.2 32.06,39.69 31.75,39.37 31.75,38.1 31.43,37.78 C18.2 VR1.E 30.48,33.02 31.11,32.38 31.75,32.38 33.02,31.11 40.64,31.11 41.91,32.38 41.91,33.02 42.55,33.66 43.81,33.66 44.45,33.02 U6.3
MBIAS  (via drill 0.25)
  Top 0.254: U3.16 36.2,11.43 35.56,12.06 v24.08,12.06
  Bottom 0.254: R28.2 23.18,11.11 24.08,12.02 v24.08,12.06
MG+
  Bottom 0.254: R30.2 R28.1 21.27,11.12 22.23,12.06 C20.1
MG-
  Bottom 0.254: C20.2 22.23,15.88 21.27,16.82 R35.2 R34.1
MIC1N  (via drill 0.25)
  Top 0.254: U3.18 38.73,11.43 v36.83,13.34
  Bottom 0.254: v36.83,13.34 SJ1.3
MIC+
  Top 0.254: JP5.1 6.99,13.34 7.3,13.02 C10.1
  Bottom 0.254: R30.1 C19.1 16.51,12.7 15.55,13.65 C21.1 7.3,13.65 6.99,13.34 JP5.1
MIC-
  Top 0.254: JP5.2 6.99,15.88 7.3,16.2 C11.1
  Bottom 0.254: R34.2 C22.1 15.88,15.24 15.56,15.55 C21.2 7.3,15.55 6.99,15.88 JP5.2
MICN  (via drill 0.25)
  Top 0.254: v30.48,14.61 30.48,13.97 29.84,13.34 26.67,13.34 25.4,14.61 v20.32,14.61
  Bottom 0.254: SJ1.2 33.02,13.97 32.38,14.61 v30.48,14.61 | C22.2 19.68,15.24 v20.32,14.61
MICP  (via drill 0.25)
  Top 0.254: U3.17 37.47,11.43 36.2,12.7 26.04,12.7 24.77,13.97 20.95,13.97 v20.32,13.34
  Bottom 0.254: C19.2 19.68,12.7 v20.32,13.34
MPEN
  Bottom 0.254: U2.2 44.45,24.13 43.81,24.77 40.64,24.77 40.01,24.13 40.01,17.78 41.27,16.51 R6.1 R9.2
Q8C
  Bottom 0.254: R4.1 23.81,30.16 24.77,29.21 Q5.3
Q9C
  Bottom 0.254: R5.1 28.25,30.16 28.57,29.84 Q6.3
R
  Top 0.254: C24.2 JP3.1
RF
  Top 0.254: VR2.A 36.83,34.29 37.15,33.98 C25.2
  Bottom 0.254: VR2.A 35.56,38.73 36.2,39.37 VR2.S
RFB  (via drill 0.25)
  Top 0.254: C23.2 R32.2 46.35,36.83 v46.99,36.2 49.53,36.2 50.16,35.56 50.16,32.38 51.12,31.43 C24.1
  Bottom 0.254: U6.7 45.72,36.83 46.35,36.2 v46.99,36.2
RIN  (via drill 0.25)
  Top 0.254: v31.75,22.23 31.11,22.86 9.21,22.86 C14.2 | U3.21 38.73,22.23 38.1,21.59 v34.92,21.59
  Bottom 0.254: v34.92,21.59 32.38,21.59 v31.75,22.23
RIN1  (via drill 0.25)
  Top 0.254: U3.15 v34.92,11.43
  Bottom 0.254: SJ1.1 31.5,12.32 32.38,11.43 v34.92,11.43
RNEG  (via drill 0.25)
  Top 0.254: C23.1 R32.1 43.5,35.88 v43.18,35.56
  Bottom 0.254: v43.18,35.56 U6.5
ROUT
  Top 0.254: 30.48,32.38 29.84,31.75 U3.28 | 30.48,32.38 32.07,32.38 32.7,31.75 C25.1 | TP4.TP 28.07,32.38 30.48,32.38
RPOS  (via drill 0.25)
  Top 0.254: v44.45,35.56 44.45,34.92 43.81,34.29 VR2.E
  Bottom 0.254: R36.2 33.02,32.38 33.66,31.75 40.01,31.75 40.64,32.38 VR2.E 39.37,34.29 39.05,34.61 C26.2 | U6.6 v44.45,35.56
RXD
  Top 0.254: U3.37 18.41,29.84 17.78,30.48 10.16,30.48 9.53,31.11 JP2.1
SW  (via drill 0.35)
  Top 0.406: v41.27,22.86 41.42,22.71 L1.P$2 45.72,23.34 44.97,24.1 D1.C
  Bottom 0.406: C1.2 41.27,21.59 | 41.27,21.59 v41.27,22.86 | U2.1 42.44,22.76 41.27,21.59
TXD
  Top 0.254: U3.36 19.68,29.84 18.41,31.11 11.43,31.11 10.79,31.75 10.79,35.56 JP2.2
U4FB
  Bottom 0.254: U4.7 U4.6
V+  (via drill 0.35)
  Top 0.406: Q2.2 R1.2 48.58,8.84 49.27,9.53 F1.1 47.62,11.43 47.24,11.81 | 47.24,11.81 v47.24,11.9 | 47.24,11.81 46.99,12.06 46.35,12.06 45.72,11.43 D2.C
  Bottom 0.406: U2.7 44.45,15.24 43.69,14.47 C3.1 43.69,12.2 44.45,11.43 | 44.45,11.43 46.35,11.43 46.83,11.9 v47.24,11.9 | R6.2 41.59,11.43 44.45,11.43
VRAW
  Top 0.406: F1.2 52.07,11.43 JP1.9
VSW
  Top 0.254: U3.32 24.77,26.67 25.4,26.04 33.66,26.04 34.29,25.4 34.29,15.88 34.92,15.24 36.83,15.24 37.78,14.29 R2.2
VSWB
  Top 0.254: Q3.1 40.91,11.7 41.59,12.38 R2.1
VSWC
  Top 0.254: R1.1 Q2.1 50.48,5.39 50.16,5.08 48.26,5.08 47.62,4.45 43.81,4.45 43.01,5.25 Q3.3 43.01,8.47 TP6.TP

### Text on the board
tPlace: TXD | EN | EXT4 | EXT2 | +3V3 | GND | RXD | EXT5 | EXT3 | EXT1 | +5V | +12V | R | AUXL | GND | AUXR | L | CTRL | GND | +5V | GND | CH3 | CH4 | MIC- | CH1 | CH2 | MIC+ | CANH | CANL | V+ | GND | 5V | 12V
bPlace: ES8388 | AC101
tNames: Extra IO | 2023-03 | JLCJLCJLCJLC | Main | CE-04 | CDCEmu v4.0
bNames: CDCEmu v4.0 | © kuba2k2